# Altium schematic sheet BLUENRG-345_REV1_Sheet1.SchDoc: = Title
size A3; Author: FELIPE; DocumentNumber: 1; SheetNumber: 1; SheetTotal: 3; DocumentName: Sheet1.SCHDOC
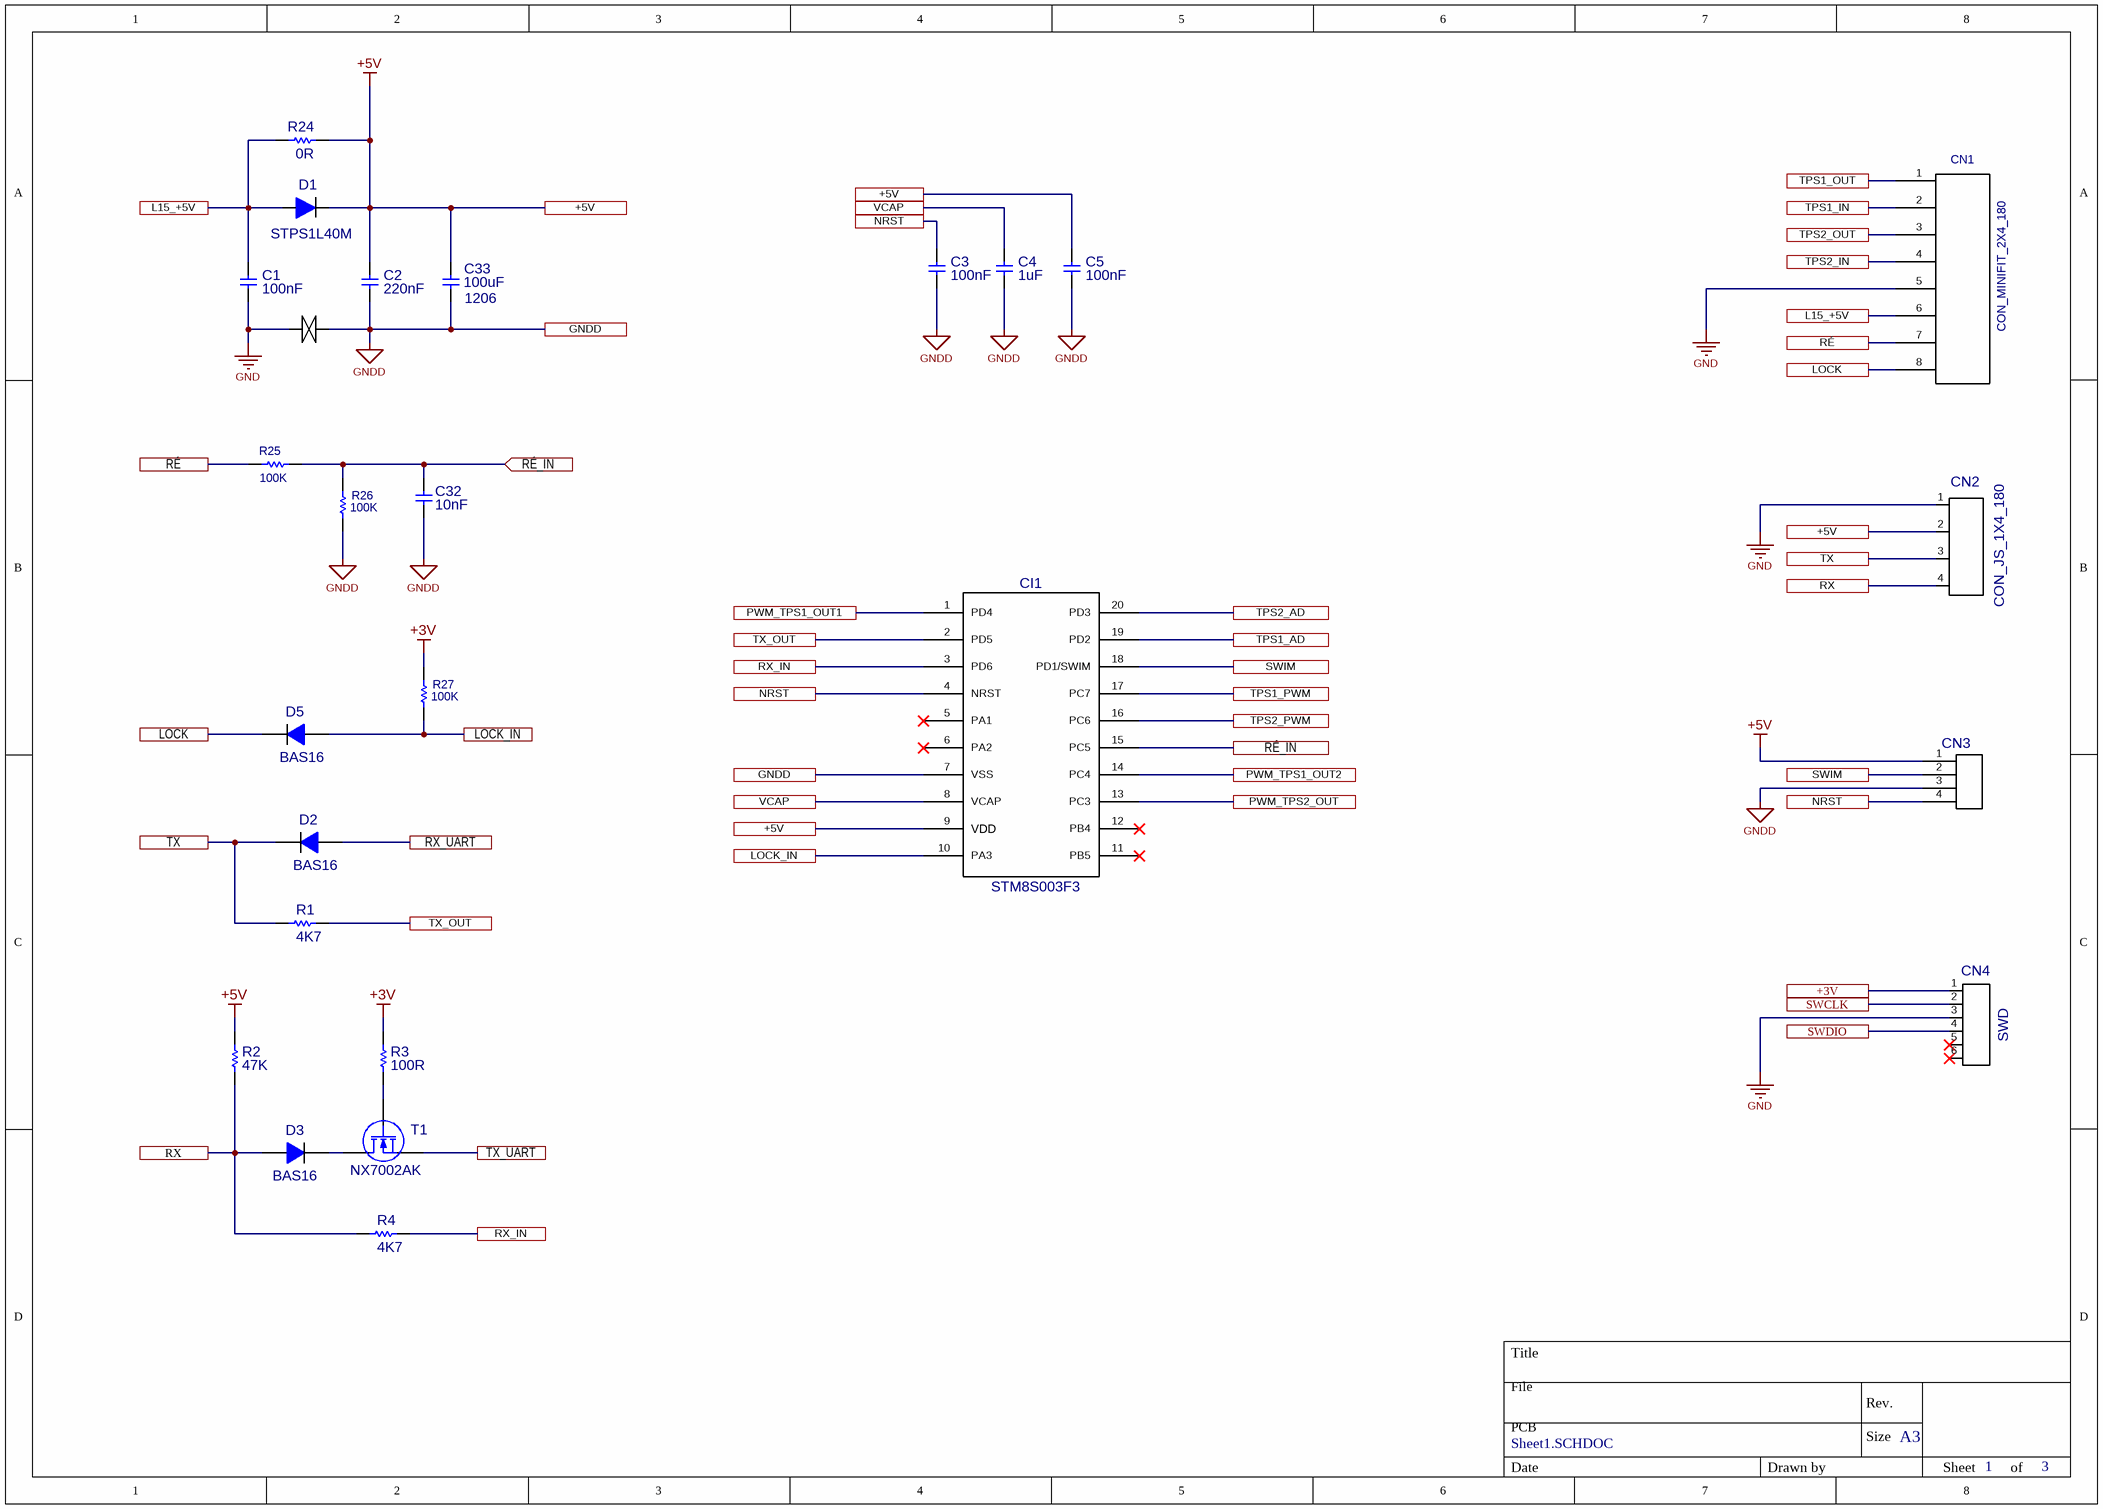
[diagram p0: BLUENRG-345_REV1_Sheet1.SchDoc]

## Parts
C1  value 100nF  [C0402_REV1]  (hidden comment: C0402)
C2  value 220nF  [C0402_REV1]  (hidden comment: C0402)
C3  value 100nF  [C0402_REV1]  (hidden comment: C0402)
C4  value 1uF  [C0402_REV1]  (hidden comment: C0402)
C5  value 100nF  [C0402_REV1]  (hidden comment: C0402)
C32  value 10nF  [C0402_REV1]  (hidden comment: C0402)
C33  value 100uF  Encapsulamento: 1206  [C1206_rev1]  (hidden comment: C1206)
CI1  value STM8S003F3  [TSSOP20]  (hidden comment: CI_STM8S003F3_TSSOP20)
CN1  CON_MINIFIT_2X4_180  [CONECTOR_MINIFIT_2X4_180]
CN2  CON_JS_1X4_180  [CONECTOR_ 1x4 2.0mm - 180°]
CN3  CON_BP1X4_180  [CONECTOR_BP1X4_SWIM_180]  (value not drawn)
CN4  value SWD  [CONECTOR_BP1X6_180]  (hidden comment: CON_BP1X6_180)
D1  value STPS1L40M  [DO216AA_REV1]  (hidden comment: D_STPS1L40M_DO216AA)
D2  value BAS16  [SOD323_IPC]  (hidden comment: D_BAS16_SOD323)
D3  value BAS16  [SOD323_IPC]  (hidden comment: D_BAS16_SOD323)
D5  value BAS16  [SOD323_IPC]  (hidden comment: D_BAS16_SOD323)
NT1  NET TIE 30mils  [NET TIE 30mils]  (value not drawn)  (net tie, no BOM)
R1  value 4K7  [R0402_REV1]  (hidden comment: RES 0402 4K7 1/16W 5%)
R2  value 47K  [R0402_REV1]  (hidden comment: R0603)
R3  value 100R  [R0402_REV1]  (hidden comment: R0603)
R4  value 4K7  [R0402_REV1]  (hidden comment: RES 0402 4K7 1/16W 5%)
R24  value 0R  [R0402_REV1]  (hidden comment: RES 0402 0R 1/16W 5%)
R25  value 100K  [R0402_REV1]  (hidden comment: R0402)
R26  value 100K  [R0402_REV1]  (hidden comment: R0402)
R27  value 100K  [R0402_REV1]  (hidden comment: R0402)
T1  NX7002AK  [SOT23_REV1]

## Ports
+3V, +5V, GNDD, L15_+5V, LOCK, LOCK_IN, NRST, PWM_TPS1_OUT1, PWM_TPS1_OUT2, PWM_TPS2_OUT, RX, RX_IN, RX_UART, RÉ, RÉ_IN, RÉ_IN (in), SWCLK, SWDIO, SWIM, TPS1_AD, TPS1_IN, TPS1_OUT, TPS1_PWM, TPS2_AD, TPS2_IN, TPS2_OUT, TPS2_PWM, TX, TX_OUT, TX_UART, VCAP

## Nets
+3V: R3.2 R27.1
+5V: C2.1 C5.1(+) C33.2 CI1.9(VDD) CN2.2 CN3.1 D1.1(K) R2.2 R24.1 ; port +5V
GND: C1.2(-) CN1.5 CN2.1 CN4.3 NT1.2
GNDD: C2.2 C3.2(-) C4.2 C5.2(-) C32.1 C33.1 CI1.7(VSS) CN3.3 NT1.1 R26.2 ; port GNDD
+3V: CN4.1 ; port +3V  [a separate net that carries the same name]
L15_+5V: C1.1(+) CN1.6 D1.2(A) R24.2 ; port L15_+5V
LOCK: CN1.8 D5.2(K) ; port LOCK
LOCK_IN: CI1.10(PA3) D5.1(A) R27.2 ; port LOCK_IN
NRST: C3.1(+) CI1.4(NRST) CN3.4 ; port NRST
PWM_TPS1_OUT1: CI1.1(PD4) ; port PWM_TPS1_OUT1
PWM_TPS1_OUT2: CI1.14(PC4) ; port PWM_TPS1_OUT2
PWM_TPS2_OUT: CI1.13(PC3) ; port PWM_TPS2_OUT
RX: CN2.4 D3.1(A) R2.1 R4.1 ; port RX
RX_IN: CI1.3(PD6) R4.2 ; port RX_IN
RX_UART: D2.1(A) ; port RX_UART
RÉ: CN1.7 R25.2 ; port RÉ
RÉ_IN: C32.2 CI1.15(PC5) R25.1 R26.1 ; port RÉ_IN
SWCLK: CN4.2 ; port SWCLK
SWDIO: CN4.4 ; port SWDIO
SWIM: CI1.18(PD1/SWIM) CN3.2 ; port SWIM
TPS1_AD: CI1.19(PD2) ; port TPS1_AD
TPS1_IN: CN1.2 ; port TPS1_IN
TPS1_OUT: CN1.1 ; port TPS1_OUT
TPS1_PWM: CI1.17(PC7) ; port TPS1_PWM
TPS2_AD: CI1.20(PD3) ; port TPS2_AD
TPS2_IN: CN1.4 ; port TPS2_IN
TPS2_OUT: CN1.3 ; port TPS2_OUT
TPS2_PWM: CI1.16(PC6) ; port TPS2_PWM
TX: CN2.3 D2.2(K) R1.1 ; port TX
TX_OUT: CI1.2(PD5) R1.2 ; port TX_OUT
TX_UART: T1.2(S) ; port TX_UART
VCAP: C4.1 CI1.8(VCAP) ; port VCAP
NetD3_2: D3.2(K) T1.3(D)
NetR3_1: R3.1 T1.1(G)

Not connected (* = marked no-connect by the designer): CI1 5(PA1)* 6(PA2)* 11(PB5)* 12(PB4)*; CN4 5* 6*

## Notes on the sheet
- Title
- File
- PCB
- Rev.
- Size
- A3
- Date
- Drawn by
- Sheet
- of

## Library data of the parts
C1 C3 C5 = CAP_0402 100nF 10% 50V X7R: CAPACITOR 0402 100NF / 50V X7R 10%; Partnumber Fabricante 01: GCM155R71H104KE02D; Código Tury: 002.00.00015; Tipo de Montagem: SMD; Fabricante 01: MURATA; Fabricante 02: YAGEO; Partnumber Fabricante 02: CC0402KRX5R9BB104
C2 = CAP_0402 220nF 10% 16V X7R: CAPACITOR 0402 220NF / 16V X7R 10%; Partnumber Fabricante 01: GRM155R71H224KA12D; Tipo de Montagem: SMD; Código Tury: 002.00.00014; Fabricante 01: MURATA; Fabricante 02: YAGEO; Fabricante 03: TAIYO-YUDEN; Partnumber Fabricante 02: CC0402KRX7R8BB224; Partnumber Fabricante 03: UMK105BJ224KV-F
C4 = CAP_0402 1uF 10% 16V X6S: CAPACITOR 0402 1UF / 16V X6S 10%; Partnumber Fabricante 01: EMK105C6105KV-F; Tipo de Montagem: SMD; Código Tury: 002.00.00009; Fabricante 01: TAIYO-YUDEN; Fabricante 02: YAGEO; Fabricante 03: TDK; Partnumber Fabricante 02: CC0402KRX6S7BB105; Partnumber Fabricante 03: C1005X6S1C105K050BC
C32 = CAP 0603 47nF 50V X7R 10%: CAPACITOR 0402 10NF / 25V X7R 5%; Partnumber Fabricante 01: GRM155R71E103JA01J; Código Tury: 002.00.00007; Tipo de Montagem: SMD; Fabricante 01: MURATA; Fabricante 02: YAGEO; Fabricante 03: YAGEO; Partnumber Fabricante 02: CC0402KRX7R8BB103; Partnumber Fabricante 03: CC0402JRX7R8BB103
C33 = CAP_1206 100uF 6V3 X5R 20%: CAPACITOR 1206 100UF / 6V3 X5R 20%; Partnumber Fabricante 01: GMC31X5R107M6R3NT; Código Tury: 002.03.00006; Tipo de Montagem: SMD; Fabricante 01: CAL-CHIP ELECTRONICS, INC.
CI1 = CI_STM8S003F3_TSSOP20: CI MICROCONTROLADOR STM8S003F3P6; Partnumber Fabricante 01: STM8S003F3P6TR; Código Tury: 004.07.00026; Tipo de Montagem: SMD; Fabricante 01: ST
CN1 = CONECTOR_MINIFIT_2X4_180_PT: CONECTOR PCI - POTENCIA MINIFIT PT 180° 2X4X4,2MM; Tipo de Montagem: PTH; Código Tury: 014.11.00221; Value: *
CN2 = CONECTOR_JS_1X4_180: CONECTOR PCI - SINAL 180° - 1X4X2,0MM; Partnumber Fabricante 01: LW-2002P0400T; Tipo de Montagem: PTH; Código Tury: 014.10.00819; Fabricante 01: LANDWIN; Value: *
CN3 = CON_BPT_1X4_180: BARRA DE PINO - SECAO QUADRADA 180º 1X4X2,54MM; Part Number: 013.07.00104; Tipo de Montagem: PTH
CN4 = CONECTOR_BP1X6_180: Conector barra de pinos 1x6 180º; Part Number: 013.07.00108
D1 = D_STPS1L40M_DO216AA: DIODO SCHOTTKY STPS1L40M DO2126-AA; Código Tury: 005.04.00002; Tipo de Montagem: SMD
D2 D3 D5 = D_BAS16_SOD323: DIODO DE SINAL BAS16 SOD323; Partnumber Fabricante 01: BAS316; Tipo de Montagem: SMD; Código Tury: 005.00.00010; Fabricante 01: NXP; Fabricante 02: ON; Fabricante 03: VISHAY; Partnumber Fabricante 02: BAS16HT1G; Partnumber Fabricante 03: BAS16WS
NT1 = NET TIE 30mils: Value: {Value}
R1 R4 = RES 0402 4K7 1/16W 5%: RESISTOR 0402 4K7 1/16W 5%; Partnumber Fabricante 01: CRCW04024K70JNED; Código Tury: 001.00.00009; Encapsulamento: 0402; Tipo de Montagem: SMD; Fabricante 02: VIKING; Fabricante 01: VISHAY; Fabricante 03: WALSIN; Partnumber Fabricante 02: CR-02JL6---4K7; Partnumber Fabricante 03: WR04X472JTL
R2 = RES 0402 47K 1/16W 5%: RESISTOR 0402 47K 1/16W 5%; Partnumber Fabricante 01: CRCW040247K0JNEDHP; Encapsulamento: 0402; Tipo de Montagem: SMD; Código Tury: 001.00.00006; Fabricante 01: VISHAY; Fabricante 02: VIKING; Fabricante 03: HOTTECH; Partnumber Fabricante 02: CR-02JL6--47K; Partnumber Fabricante 03: RI0402L473JT
R3 = RES 0402 100R 1/16W 5%: RESISTOR 0402 100R 1/16W 5%; Partnumber Fabricante 01: CR0402AJW-101GAS; Encapsulamento: 0402; Tipo de Montagem: SMD; Código Tury: 001.00.00001; Fabricante 01: BOURNS; Fabricante 02: VIKING; Fabricante 03: WALSIN; Partnumber Fabricante 02: CR-02JL6--100R; Partnumber Fabricante 03: WR04X101JTL
R24 = RES 0402 0R 1/16W 5%: RESISTOR 0402 0R 1/16W 5%; Partnumber Fabricante 01: RC0402JR-070RL; Encapsulamento: 0402; Tipo de Montagem: SMD; Código Tury: 001.00.00024; Fabricante 01: YAGEO; Fabricante 02: WALSIN; Partnumber Fabricante 02: MR04X000PTL
R25-R27 = RES 0402 100K 1/16W 5%: RESISTOR 0402 100K 1/16W 5%; Partnumber Fabricante 01: CRCW0402100KJNED; Encapsulamento: 0402; Tipo de Montagem: SMD; Código Tury: 001.00.00005; Fabricante 01: VISHAY; Fabricante 02: VIKING; Fabricante 03: WALSIN; Partnumber Fabricante 02: CR-02JL6--100K; Partnumber Fabricante 03: WR04X104JTL
T1 = T_NX7002AK: TRANSISTOR MOSFET CANAL N 60V ,19A NX7002AK; Tipo de Montagem: SMD; Código Tury: 006.06.00013; Value: NX7002AK